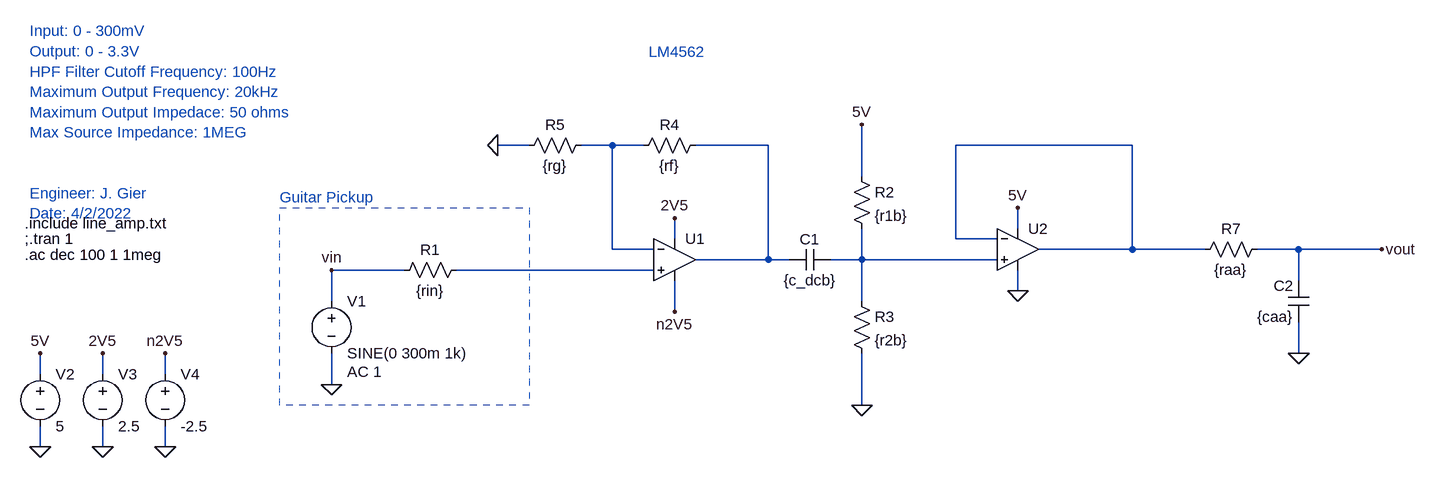
[diagram p0: schematic line_amp.asc]
line_amp.asc, the LTspice schematic file:
Version 4
SHEET 1 996 736
WIRE -384 -224 -432 -224
WIRE -256 -224 -304 -224
WIRE -208 -224 -256 -224
WIRE -16 -224 -128 -224
WIRE 544 -224 272 -224
WIRE 128 -176 128 -256
WIRE 368 -96 368 -128
WIRE -160 -80 -160 -112
WIRE 272 -80 272 -224
WIRE 336 -80 272 -80
WIRE -256 -64 -256 -224
WIRE -192 -64 -256 -64
WIRE 544 -64 544 -224
WIRE 544 -64 400 -64
WIRE 656 -64 544 -64
WIRE 800 -64 736 -64
WIRE 928 -64 800 -64
WIRE -16 -48 -16 -224
WIRE -16 -48 -128 -48
WIRE 16 -48 -16 -48
WIRE 128 -48 128 -96
WIRE 128 -48 80 -48
WIRE 336 -48 128 -48
WIRE -576 -32 -688 -32
WIRE -192 -32 -496 -32
WIRE 800 -16 800 -64
WIRE 368 0 368 -32
WIRE -688 16 -688 -32
WIRE 128 16 128 -48
WIRE -160 32 -160 -16
WIRE 800 96 800 48
WIRE -1136 128 -1136 96
WIRE -1040 128 -1040 96
WIRE -944 128 -944 96
WIRE -688 144 -688 96
WIRE 128 176 128 96
WIRE -1136 240 -1136 208
WIRE -1040 240 -1040 208
WIRE -944 240 -944 208
FLAG -688 144 0
FLAG -1136 96 5V
FLAG -1136 240 0
FLAG 128 -256 5V
FLAG 128 176 0
FLAG -1040 96 2V5
FLAG -1040 240 0
FLAG -944 96 n2V5
FLAG -944 240 0
FLAG -432 -224 0
FLAG -160 -112 2V5
FLAG -160 32 n2V5
FLAG 368 -128 5V
FLAG 368 0 0
FLAG 928 -64 vout
FLAG -688 -32 vin
FLAG 800 96 0
SYMBOL voltage -688 0 R0
WINDOW 123 24 124 Left 2
WINDOW 39 0 0 Left 0
SYMATTR Value2 AC 1
SYMATTR InstName V1
SYMATTR Value SINE(0 300m 1k)
SYMBOL res -480 -48 R90
WINDOW 0 0 56 VBottom 2
WINDOW 3 32 56 VTop 2
SYMATTR InstName R1
SYMATTR Value {rin}
SYMBOL cap 80 -64 R90
WINDOW 0 0 32 VBottom 2
WINDOW 3 32 32 VTop 2
SYMATTR InstName C1
SYMATTR Value {c_dcb}
SYMBOL res 112 -192 R0
SYMATTR InstName R2
SYMATTR Value {r1b}
SYMBOL res 112 0 R0
SYMATTR InstName R3
SYMATTR Value {r2b}
SYMBOL voltage -1136 112 R0
WINDOW 123 0 0 Left 0
WINDOW 39 0 0 Left 0
SYMATTR InstName V2
SYMATTR Value 5
SYMBOL voltage -1040 112 R0
WINDOW 123 0 0 Left 0
WINDOW 39 0 0 Left 0
SYMATTR InstName V3
SYMATTR Value 2.5
SYMBOL voltage -944 112 R0
WINDOW 123 0 0 Left 0
WINDOW 39 0 0 Left 0
SYMATTR InstName V4
SYMATTR Value -2.5
SYMBOL res -112 -240 R90
WINDOW 0 0 56 VBottom 2
WINDOW 3 32 56 VTop 2
SYMATTR InstName R4
SYMATTR Value {rf}
SYMBOL res -400 -208 R270
WINDOW 0 32 56 VTop 2
WINDOW 3 0 56 VBottom 2
SYMATTR InstName R5
SYMATTR Value {rg}
SYMBOL Opamps\\UniversalOpamp -160 -48 R0
SYMATTR InstName U1
SYMBOL Opamps\\UniversalOpamp 368 -64 R0
SYMATTR InstName U2
SYMBOL res 752 -80 R90
WINDOW 0 0 56 VBottom 2
WINDOW 3 32 56 VTop 2
SYMATTR InstName R7
SYMATTR Value {raa}
SYMBOL cap 816 48 R180
WINDOW 0 24 56 Left 2
WINDOW 3 24 8 Left 2
SYMATTR InstName C2
SYMATTR Value {caa}
TEXT -1152 -400 Left 2 ;Input: 0 - 300mV\nOutput: 0 - 3.3V\nHPF Filter Cutoff Frequency: 100Hz\nMaximum Output Frequency: 20kHz\nMaximum Output Impedace: 50 ohms\nMax Source Impedance: 1MEG\n \n \nEngineer: J. Gier\nDate: 4/2/2022
TEXT -768 -144 Left 2 ;Guitar Pickup
TEXT -1160 -104 Left 2 !.include line_amp.txt
TEXT -1160 -80 Left 2 !;.tran 1
TEXT -1160 -56 Left 2 !.ac dec 100 1 1meg
TEXT -200 -368 Left 2 ;LM4562
RECTANGLE Normal -384 176 -768 -128 2

The netlist it stands for:
* line_amp.asc
V1 vin 0 SINE(0 300m 1k) AC 1
R1 N005 vin {rin}
C1 N004 N002 {c_dcb}
R2 5V N004 {r1b}
R3 N004 0 {r2b}
V2 5V 0 5
V3 2V5 0 2.5
V4 n2V5 0 -2.5
R4 N002 N001 {rf}
R5 0 N001 {rg}
XU1 N005 N001 2V5 n2V5 N002 level1 Avol=1Meg GBW=10Meg Vos=0 En=0 Enk=0 In=0 Ink=0 Rin=500Meg  ; pins In+ In- V+ V- OUT
XU2 N004 N003 5V 0 N003 level1 Avol=1Meg GBW=10Meg Vos=0 En=0 Enk=0 In=0 Ink=0 Rin=500Meg  ; pins In+ In- V+ V- OUT
R7 vout N003 {raa}
C2 0 vout {caa}
* Input: 0 - 300mV
* Output: 0 - 3.3V
* HPF Filter Cutoff Frequency: 100Hz
* Maximum Output Frequency: 20kHz
* Maximum Output Impedace: 50 ohms
* Max Source Impedance: 1MEG
* Engineer: J. Gier
* Date: 4/2/2022
* Guitar Pickup
.include line_amp.txt
;.tran 1
.ac dec 100 1 1meg
* LM4562
.lib UniversalOpAmp1.lib
.backanno
.end